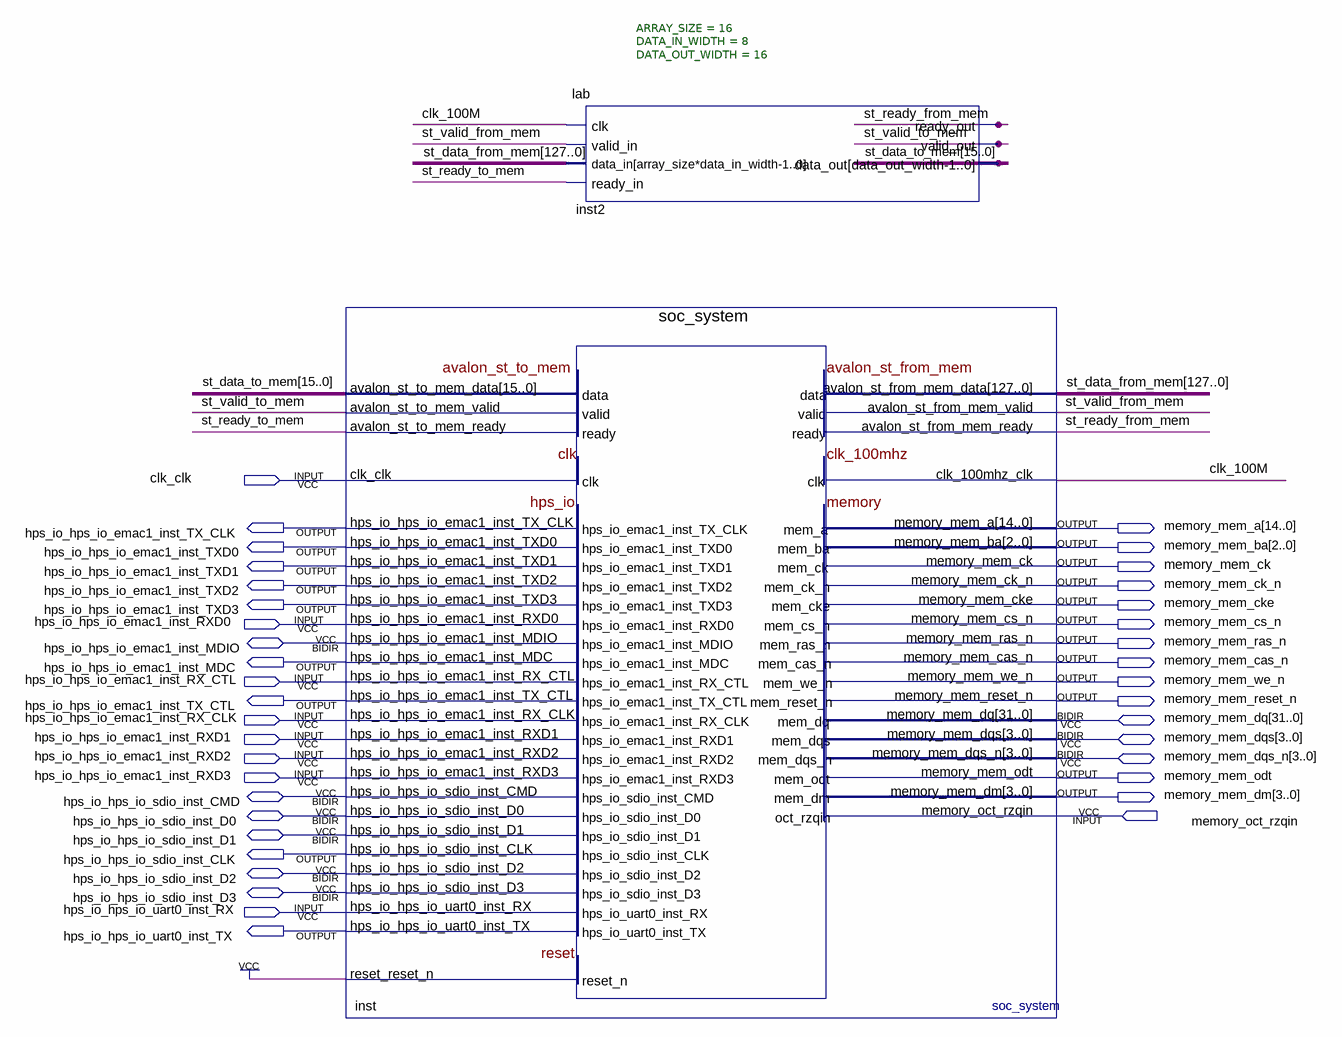
[diagram p0: schematic sheet]
// Quartus schematic main.bdf as structural Verilog: 2 symbols, 39 pins
module main (
  input  clk_clk,
  input  hps_io_hps_io_emac1_inst_RXD0,
  input  hps_io_hps_io_emac1_inst_RX_CTL,
  input  hps_io_hps_io_emac1_inst_RX_CLK,
  input  hps_io_hps_io_emac1_inst_RXD1,
  input  hps_io_hps_io_emac1_inst_RXD2,
  input  hps_io_hps_io_emac1_inst_RXD3,
  input  memory_oct_rzqin,
  input  hps_io_hps_io_uart0_inst_RX,
  inout  hps_io_hps_io_emac1_inst_MDIO,
  inout  [31:0] memory_mem_dq,
  inout  [3:0] memory_mem_dqs,
  inout  [3:0] memory_mem_dqs_n,
  inout  hps_io_hps_io_sdio_inst_CMD,
  inout  hps_io_hps_io_sdio_inst_D0,
  inout  hps_io_hps_io_sdio_inst_D1,
  inout  hps_io_hps_io_sdio_inst_D2,
  inout  hps_io_hps_io_sdio_inst_D3,
  output hps_io_hps_io_emac1_inst_TX_CLK,
  output [14:0] memory_mem_a,
  output hps_io_hps_io_emac1_inst_TXD0,
  output [2:0] memory_mem_ba,
  output hps_io_hps_io_emac1_inst_TXD1,
  output memory_mem_ck,
  output hps_io_hps_io_emac1_inst_TXD2,
  output memory_mem_ck_n,
  output hps_io_hps_io_emac1_inst_TXD3,
  output memory_mem_cke,
  output memory_mem_cs_n,
  output memory_mem_ras_n,
  output hps_io_hps_io_emac1_inst_MDC,
  output memory_mem_cas_n,
  output memory_mem_we_n,
  output hps_io_hps_io_emac1_inst_TX_CTL,
  output memory_mem_reset_n,
  output memory_mem_odt,
  output [3:0] memory_mem_dm,
  output hps_io_hps_io_sdio_inst_CLK,
  output hps_io_hps_io_uart0_inst_TX
);

  wire clk_100M, st_ready_from_mem, st_ready_to_mem, st_valid_from_mem, st_valid_to_mem;
  wire [15:0] st_data_to_mem;
  wire [127:0] st_data_from_mem;

  soc_system inst (
    .avalon_st_from_mem_ready(st_ready_from_mem), .avalon_st_to_mem_data(st_data_to_mem),
    .avalon_st_to_mem_valid(st_valid_to_mem), .clk_clk(clk_clk),
    .hps_io_hps_io_emac1_inst_RXD0(hps_io_hps_io_emac1_inst_RXD0),
    .hps_io_hps_io_emac1_inst_RX_CTL(hps_io_hps_io_emac1_inst_RX_CTL),
    .hps_io_hps_io_emac1_inst_RX_CLK(hps_io_hps_io_emac1_inst_RX_CLK),
    .hps_io_hps_io_emac1_inst_RXD1(hps_io_hps_io_emac1_inst_RXD1),
    .hps_io_hps_io_emac1_inst_RXD2(hps_io_hps_io_emac1_inst_RXD2),
    .hps_io_hps_io_emac1_inst_RXD3(hps_io_hps_io_emac1_inst_RXD3),
    .hps_io_hps_io_uart0_inst_RX(hps_io_hps_io_uart0_inst_RX), .memory_oct_rzqin(memory_oct_rzqin),
    .reset_reset_n(1'b1), .avalon_st_from_mem_data(st_data_from_mem),
    .avalon_st_from_mem_valid(st_valid_from_mem), .avalon_st_to_mem_ready(st_ready_to_mem),
    .clk_100mhz_clk(clk_100M), .hps_io_hps_io_emac1_inst_TX_CLK(hps_io_hps_io_emac1_inst_TX_CLK),
    .hps_io_hps_io_emac1_inst_TXD0(hps_io_hps_io_emac1_inst_TXD0),
    .hps_io_hps_io_emac1_inst_TXD1(hps_io_hps_io_emac1_inst_TXD1),
    .hps_io_hps_io_emac1_inst_TXD2(hps_io_hps_io_emac1_inst_TXD2),
    .hps_io_hps_io_emac1_inst_TXD3(hps_io_hps_io_emac1_inst_TXD3),
    .hps_io_hps_io_emac1_inst_MDC(hps_io_hps_io_emac1_inst_MDC),
    .hps_io_hps_io_emac1_inst_TX_CTL(hps_io_hps_io_emac1_inst_TX_CTL),
    .hps_io_hps_io_sdio_inst_CLK(hps_io_hps_io_sdio_inst_CLK),
    .hps_io_hps_io_uart0_inst_TX(hps_io_hps_io_uart0_inst_TX), .memory_mem_a(memory_mem_a),
    .memory_mem_ba(memory_mem_ba), .memory_mem_ck(memory_mem_ck), .memory_mem_ck_n(memory_mem_ck_n),
    .memory_mem_cke(memory_mem_cke), .memory_mem_cs_n(memory_mem_cs_n), .memory_mem_ras_n(memory_mem_ras_n),
    .memory_mem_cas_n(memory_mem_cas_n), .memory_mem_we_n(memory_mem_we_n),
    .memory_mem_reset_n(memory_mem_reset_n), .memory_mem_odt(memory_mem_odt), .memory_mem_dm(memory_mem_dm),
    .hps_io_hps_io_emac1_inst_MDIO(hps_io_hps_io_emac1_inst_MDIO),
    .hps_io_hps_io_sdio_inst_CMD(hps_io_hps_io_sdio_inst_CMD),
    .hps_io_hps_io_sdio_inst_D0(hps_io_hps_io_sdio_inst_D0),
    .hps_io_hps_io_sdio_inst_D1(hps_io_hps_io_sdio_inst_D1),
    .hps_io_hps_io_sdio_inst_D2(hps_io_hps_io_sdio_inst_D2),
    .hps_io_hps_io_sdio_inst_D3(hps_io_hps_io_sdio_inst_D3), .memory_mem_dq(memory_mem_dq),
    .memory_mem_dqs(memory_mem_dqs), .memory_mem_dqs_n(memory_mem_dqs_n));
  lab #(.ARRAY_SIZE(16), .DATA_IN_WIDTH(8), .DATA_OUT_WIDTH(16)) inst2 (
    .clk(clk_100M), .valid_in(st_valid_from_mem), .data_in(st_data_from_mem), .ready_in(st_ready_to_mem),
    .ready_out(st_ready_from_mem), .valid_out(st_valid_to_mem), .data_out(st_data_to_mem));
endmodule
